# EAGLE design Adafruit ST25DV16 (EAGLE 9.6.2)
COMPANY: ADAFRUIT INDUSTRIES; DRAWN: KTOWN; REV: A
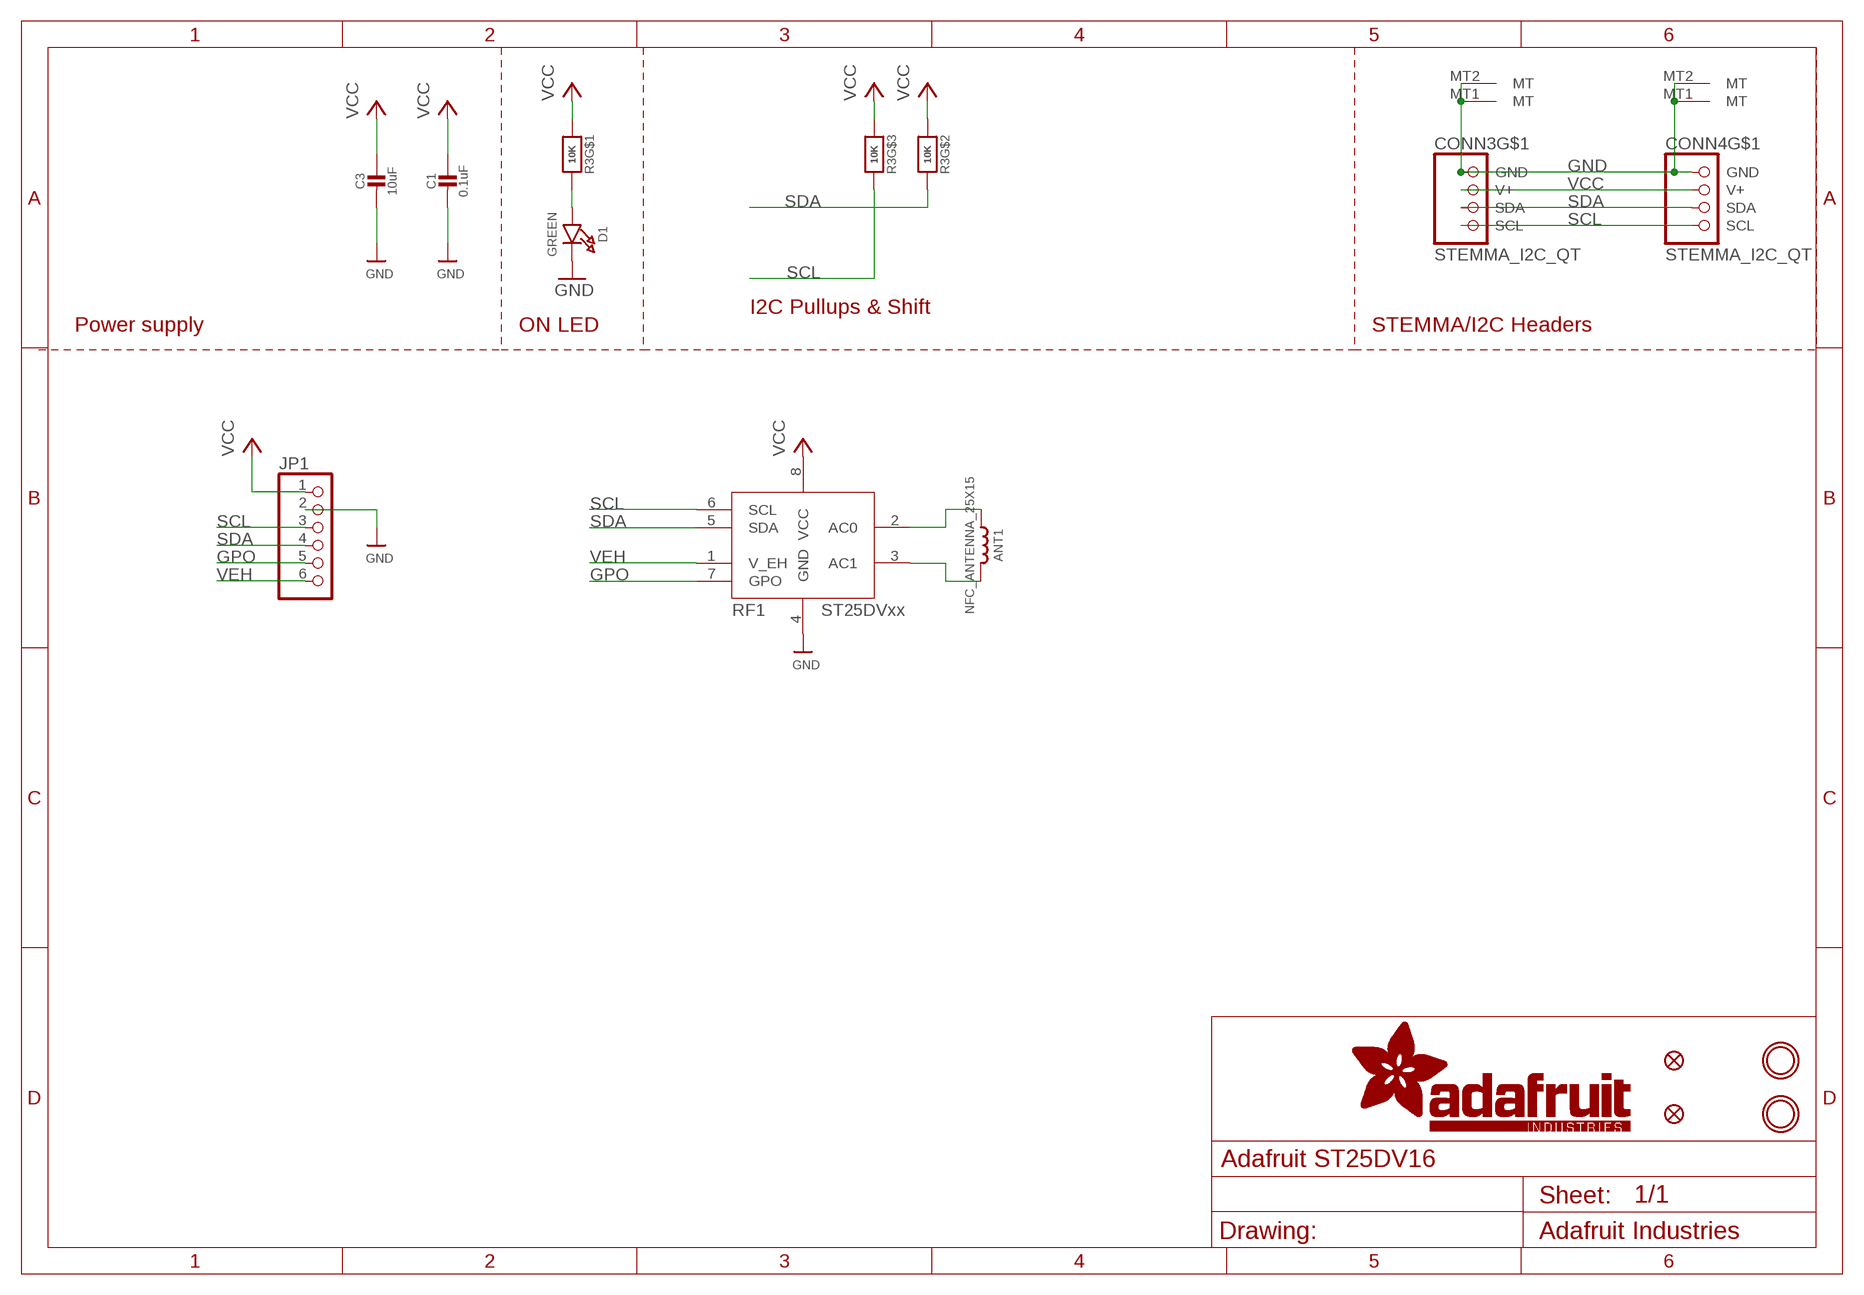
[diagram p0: schematic, sheet 1]

## Parts
ANT1  NFC_ANTENNA_25X15  [NFCANT_25X15]
C1  0.1uF  CAP_CERAMIC0603_NO  [0603-NO]
C3  10uF  CAP_CERAMIC0805-NOOUTLINE  [0805-NO]
CONN3  STEMMA_I2C_QT  [JST_SH4]
CONN4  STEMMA_I2C_QT  [JST_SH4]
D1  GREEN  LED0603_NOOUTLINE  [CHIPLED_0603_NOOUTLINE]
FID3  FIDUCIAL_1MM  [FIDUCIAL_1MM]
FID4  FIDUCIAL_1MM  [FIDUCIAL_1MM]
JP1  HEADER-1X670MIL  [1X06_ROUND_70]
R3  10K  RESISTOR_4PACK  [RESPACK_4X0603]
RF1  ST25DVXX_TSSOP  [TSSOP8-4.4MM]
U$19  MOUNTINGHOLE2.5  [MOUNTINGHOLE_2.5_PLATED]
U$21  MOUNTINGHOLE2.5  [MOUNTINGHOLE_2.5_PLATED]

## Nets
GND [highpower]: C1.2 C3.2 CONN3.1(GND) CONN3.MT1(MT) CONN3.MT2(MT) CONN4.1(GND) CONN4.MT1(MT) CONN4.MT2(MT) D1.C JP1.2 RF1.4(GND)
GPO: JP1.5 RF1.7(GPO)
N$1: D1.A R3.8
N$2: ANT1.P$2 RF1.2(AC0)
N$3: ANT1.P$1 RF1.3(AC1)
SCL: CONN3.4(SCL) CONN4.4(SCL) JP1.3 R3.6 RF1.6(SCL)
SDA: CONN3.3(SDA) CONN4.3(SDA) JP1.4 R3.7 RF1.5(SDA)
VCC [highpower]: C1.1 C3.1 CONN3.2(V+) CONN4.2(V+) JP1.1 R3.1 R3.2 R3.3 RF1.8(VCC)
VEH: JP1.6 RF1.1(V_EH)
Unconnected: R3.4 R3.5

## Notes on the sheet
- I2C Pullups & Shift
- Power supply | ON LED | STEMMA/I2C Headers

## Library data of the parts
ANT1 = microbuilder:NFC_ANTENNA
C1 C3 = microbuilder:CAP_CERAMIC: Ceramic Capacitors For new designs, use the packages preceded by an '_' character since they are more reliable: The following footprints should be used on most boards: _0402 - Standard footprint for regular board layouts _0603 - Standard footprint for regular board layouts _0805 - Standard footprint for regular board layouts _1206 - Standard footprint for regular board layouts For extremely tight-pitch boards where space is at a premium, the following 'micro-pitch' footprints can be used (smaller pads, no silkscreen outline, etc.): _0402MP - Micro-pitch footprint for very dense/compact boards _0603MP - Micro-pitch footprint for very dense/compact boards _0805MP - Micro-pitch footprint for very dense/compact boards _1206MP - Micro-pitch footprint for very dense/compact boards
CONN3 CONN4 = microbuilder:STEMMA_I2C
D1 = microbuilder:LED: LED 0603 - 0603 Surface Mount Package 2mA: Green LED - Low Power (3.9mcd, 2ma, 1.7Vf) - Digikey: 475-2709-2-ND Orange LED - Low Power (9.8mcd, 2ma, 1.8Vf) - Digikey: 475-1194-2-ND Red LED - Low Power (5mcd, 2ma, 1.8Vf) - Digikey: 475-1195-2-ND Yellow LED - Low Power (7mcd, 2ma, 1.8Vf) - Digikey: 475-1196-2-ND 5mA: Blue LED - Low Power (17mcd, 5ma, 2.9Vf) - Digikey: LNJ937W8CRACT-ND 0805 - 0805 Surface Mount Package 2mA: Red LED (8.8mcd, 2mA, 1.8Vf, Clear) - Low Power [Digikey: 475-2510-1-ND] Green LED (5mcd, 2mA, 1.8Vf, Clear) - Low Power [Digikey: 475-2730-1-ND] Yellow LED (11.3mcd, 2mA, 1.8Vf, Clear) - Low Power [Digikey: 475-2555-1-ND] 20mA: Red LED (104mcd, 20mA, Diffused) - LS R976 [Digikey: 475-1278-6-ND] Red LED (12mcd, 20mA, 2.0Vf, Clear) - APT2012EC [Digikey: 754-1128-1-ND] Green LED (15mcd, 20mA, 2.2Vf, Clear) - APT2012GC [Digikey: 754-1131-1-ND] Orange LED (160mcd, 20mA, 2.1Vf, Clear) - APT2012SECK [Digikey: 754-1130-1-ND] 1206 - 1206 Surface Mount Package Green LED (26mcd, 20mA, Diffused) - LG N971 [Digikey: 475-1407-6-ND] Red LED (15mcd, 20mA, Diffused) - LH N974 [Digikey: 475-1416-6-ND] Cree - Cree High-Power Surface Mount LEDs XPEBWT-L1-0000-00D50 - White 111lm 350mA 2.9Vf 6200K 110° XTEAWT-00-0000-00000LEE3 - White 114lm 350mA 2.85Vf 5000K 115° Everlight - Everlight 45-21 Series Surface Mount LEDs 45-21/QK2C-B2832AC2CB2/2T - Warm White 2000mcd 20mA 3.25Vf 3050K 120° 45-21/LK2C-B38452C4CB2/2T - Nuetral White 2000mcd 20mA 3.25Vf 4150K 120° 45-21/LK2C-B50634C6CB2/2T - Cold White 2200mcd 20mA 3.25Vf 5650K 120° PLCC2 Reverse Mount LS T77K-J1L2-1-0-2-R18-Z - Red 11.25mcd 2mA 1.8Vf 630nm 120° LO T77K-L1M2-24-Z - Orange 19.6mcd 2mA 1.8Vf 606nm 120° LY T77K-K2M1-26-Z - Yellow 15.7mcd 2mA 1.8Vf 587nm 120°
FID3 FID4 = microbuilder:FIDUCIAL: Fiducial Alignment Points Various fiducial points for machine vision alignment.; BOM: EXCLUDE
JP1 = microbuilder:HEADER-1X6: PIN HEADER
R3 = microbuilder:RESISTOR_4PACK: Resistor Packs (4 resistors) 4 x 0603 10K 1/16W - Digikey: YC164J-10KCT-ND
RF1 = microbuilder:ST25DVXX
U$19 U$21 = microbuilder:MOUNTINGHOLE: Mounting Hole For #2 screws (0.086"/2.18mm width, 0.094"/2.4mm hole) use 2.5mm; BOM: EXCLUDE

## Net classes
1 highpower: width 0.305 mm, drill 0.483 mm
2 lowpower: width 0.254 mm, drill 0.483 mm

## Board
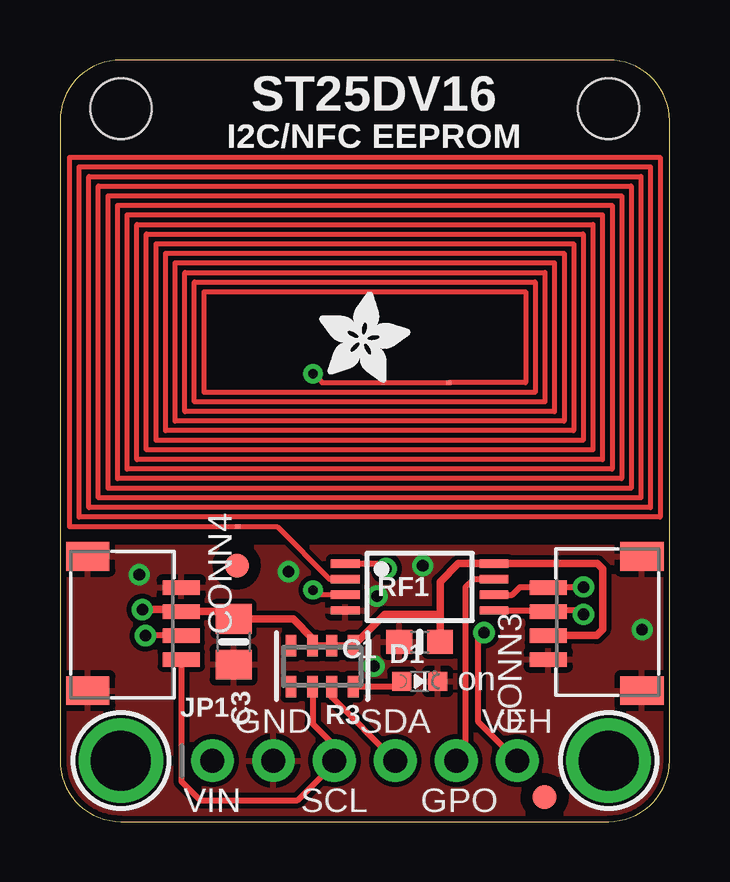
[diagram p1: board, top side]
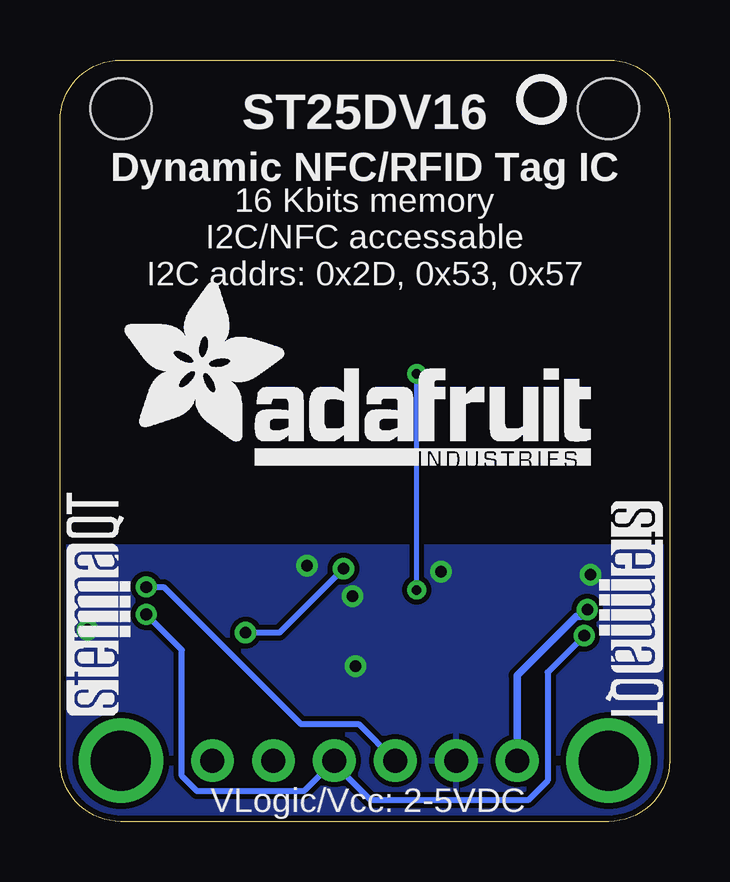
[diagram p2: board, bottom side, seen from below]

Size 25.4 x 31.75 mm. Coordinates in mm from the lower left corner, seen from the top.
Outline: 25.4,2.54 25.4,29.21 arc90 22.86,31.75 2.54,31.75 arc90 0,29.21 0,2.54 arc90 2.54,0 22.86,0 arc90 25.4,2.54
Copper layers (1*16): Top 0.035mm / dielectric 1.5mm / Bottom 0.035mm
Design rules "adafruit *": minimum track width 7mil, minimum drill 15.5mil, track to track 8mil, track to pad 8mil, pad to pad 8mil, via to via 8mil, smd to smd 8mil, copper to edge 10mil, drill to drill 8mil, minimum pad ring 10mil, minimum via ring 8mil, stop-mask expansion 2mil, vias tented up to drill 20mil, thermal gap 10mil
Holes 2.54 mm at 2.54,29.72 22.86,29.72

### Footprints (pad centres in the part's own frame; a part is rotated, then mirrored left to right if it is on the bottom)
NFCANT_25X15 = smd 0.2 x 0.2: P$1 3.5,-1.9; P$2 -5.3,-7.9
0603-NO = smd 1.075 x 1: 1 -0.85,0; 2 0.85,0
0805-NO = smd 1.24 x 1.5: 1 -0.95,0; 2 0.95,0
JST_SH4 = smd 0.6 x 1.55: 1 -1.5,2.514; 2 -0.5,2.514; 3 0.5,2.514; 4 1.5,2.514 | smd 1.2 x 1.8: MT1 -2.8,-1.386; MT2 2.8,-1.386
CHIPLED_0603_NOOUTLINE = smd 0.8 x 0.8: A 0,-0.75; C 0,0.75
FIDUCIAL_1MM = smd 1 x 1: 1 0,0
1X06_ROUND_70 = drill 1 pad 1.778: 1 -6.35,0; 2 -3.81,0; 3 -1.27,0; 4 1.27,0; 5 3.81,0; 6 6.35,0
RESPACK_4X0603 = smd 0.45 x 0.9: 1 -1.3,-0.85; 2 -0.4,-0.85; 3 0.4,-0.85; 4 1.3,-0.85; 5 1.3,0.85; 6 0.4,0.85; 7 -0.4,0.85; 8 -1.3,0.85
TSSOP8-4.4MM = smd 1.2 x 0.35: 1 -3.1,0.975; 2 -3.1,0.325; 3 -3.1,-0.325; 4 -3.1,-0.975; 5 3.1,-0.975; 6 3.1,-0.325; 7 3.1,0.325; 8 3.1,0.975
MOUNTINGHOLE_2.5_PLATED = drill 2.5 pad 3.2: P$1 0,0

### Placement (x,y rotation side)
ANT1  12.7,20.19 0 top
C1  14.99,7.49 180 top
C3  7.24,7.49 270 top
CONN3  22.86,8.26 90 top
CONN4  2.54,8.26 270 top
D1  14.99,5.84 270 top
FID3  7.37,10.67 0 top
FID4  20.19,1.02 0 top
JP1  12.7,2.54 0 top
R3  10.92,6.48 180 top
RF1  14.99,9.78 0 top
U$1  [ADAFRUIT_TEXT_20MM]  22.86,14.86 0 bottom
U$19  2.54,2.54 0 top
U$21  22.86,2.54 0 top
U$22  [ADAFRUIT_3.5MM]  10.79,18.29 0 top
U$25  [PCBFEAT-REV-040]  5.33,30.1 0 bottom
U$30  [STEMMAQT]  22.48,4.45 90 bottom
U$31  [STEMMAQT]  2.92,13.34 270 bottom

### Tracks (layer width: path | path; a pad name or v marks a point on that pad's centre or on a via)
GND  (via drill 0.48)
  other vias: 3.3,10.29 13.08,6.48 13.21,9.4 9.53,10.41 15.11,10.67 24.26,8
  pour Top: 0,0 0,11.43 25.4,11.43 25.4,0
  pour Bottom: 0,11.43 25.4,11.43 25.4,0 0,0
GPO
  Top 0.254: RF1.7 17.22,10.1 16.89,9.78 16.89,2.92 JP1.5
N$1
  Top 0.254: R3.8 14.02,5.63 D1.A
N$2
  Top 0.2: ANT1.P$2 9.04,12.29 11.23,10.1 RF1.2
N$3  (via drill 0.39)
  Top 0.203: RF1.3 10.74,9.45 v10.54,9.65 | v10.54,18.67 10.92,18.29 ANT1.P$1
  Bottom 0.2: v10.54,9.65 10.54,17.91
  Bottom 0.203: 10.54,17.91 v10.54,18.67
SCL  (via drill 0.48)
  Top 0.254: RF1.6 18.85,9.45 19.18,9.78 20.32,9.78 CONN3.4 20.37,9.78 v21.81,9.78 | CONN4.4 5.05,1.68 5.84,0.89 9.91,0.89 11.43,2.41 JP1.3 11.43,3.17 10.52,4.08 R3.6
  Bottom 0.254: JP1.3 12.95,4.06 15.37,4.06 21.08,9.78 v21.81,9.78
SDA  (via drill 0.48)
  Top 0.254: RF1.5 20.3,8.8 | 20.3,8.8 CONN3.3 | v21.81,8.64 21.64,8.8 20.3,8.8 | CONN4.3 v3.56,7.75 | R3.7 11.32,5.19 JP1.4
  Bottom 0.254: JP1.4 14.03,2.48 | 14.03,2.48 15.24,1.27 19.68,1.27 20.32,1.91 20.32,7.15 v21.81,8.64 | v3.56,7.75 5.08,6.22 5.08,1.71 5.9,0.89 12.45,0.89 14.03,2.48
VCC  (via drill 0.48)
  Top 0.305: 15.84,8.64 15.84,9.99 16.6,10.75 RF1.8 22.39,10.75 22.61,10.54 22.61,8 22.36,7.75 CONN3.2 | 15.84,8.64 C1.1 | 10.54,7.33 R3.2 R3.1 13.53,8.64 15.84,8.64 | 10.54,7.33 R3.3 | 10.54,7.33 10.54,7.62 9.72,8.44 C3.1 6.93,8.76 CONN4.2 4.97,8.84 v3.43,8.84
  Bottom 0.305: v3.43,8.84 3.72,8.55 3.89,8.55 6.35,6.08 JP1.1
VEH  (via drill 0.48)
  Top 0.254: RF1.1 13.38,10.75 v13.59,10.54 | v17.67,7.87 17.41,7.62 17.41,4.18 JP1.6
  Bottom 0.254: v13.59,10.54 16.26,7.87 v17.67,7.87

### Text on the board
tPlace: ST25DV16 | I2C/NFC EEPROM | on | GND | SDA | VEH | VIN | SCL | GPO
bPlace: ST25DV16 | Dynamic NFC/RFID Tag IC | 16 Kbits memory / I2C/NFC accessable / I2C addrs: 0x2D, 0x53, 0x57 | VLogic/Vcc: 2-5VDC